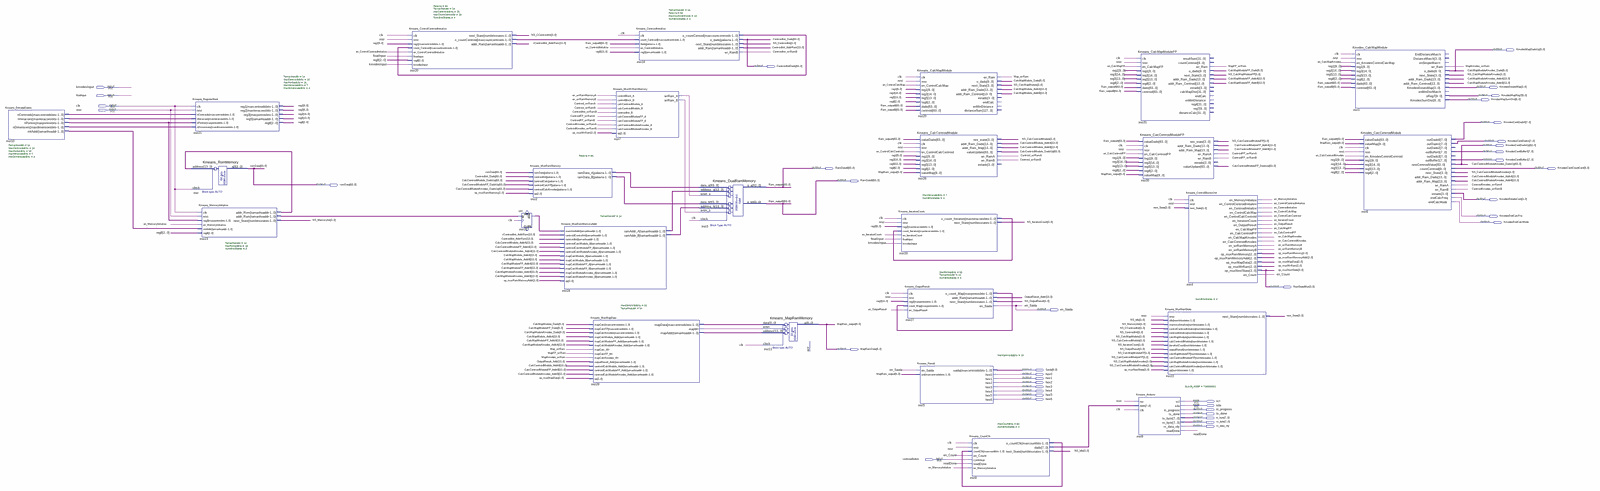
[diagram p0: schematic sheet, whole]
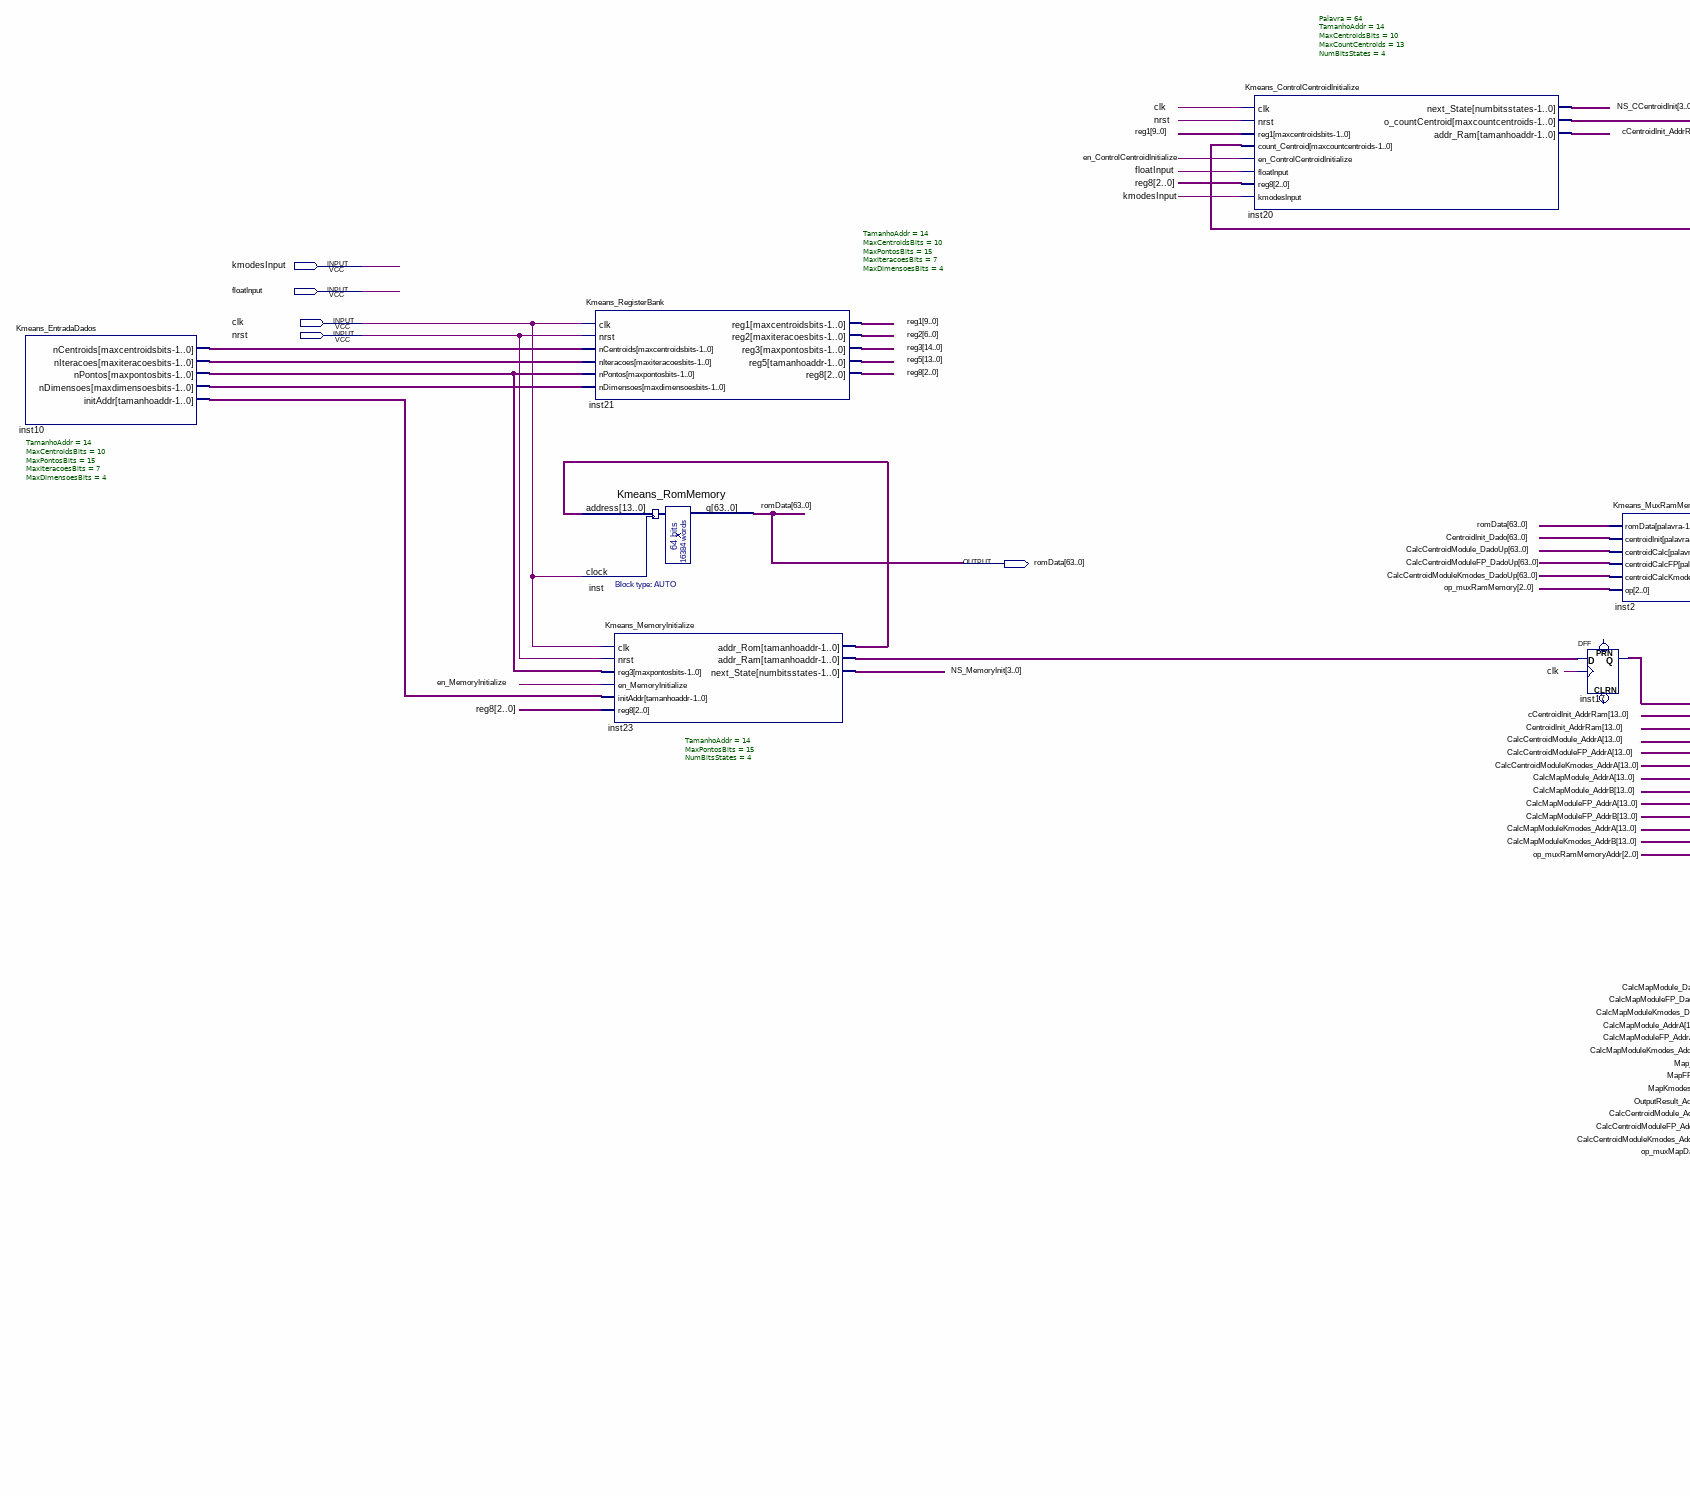
[diagram p1: schematic sheet, left part]
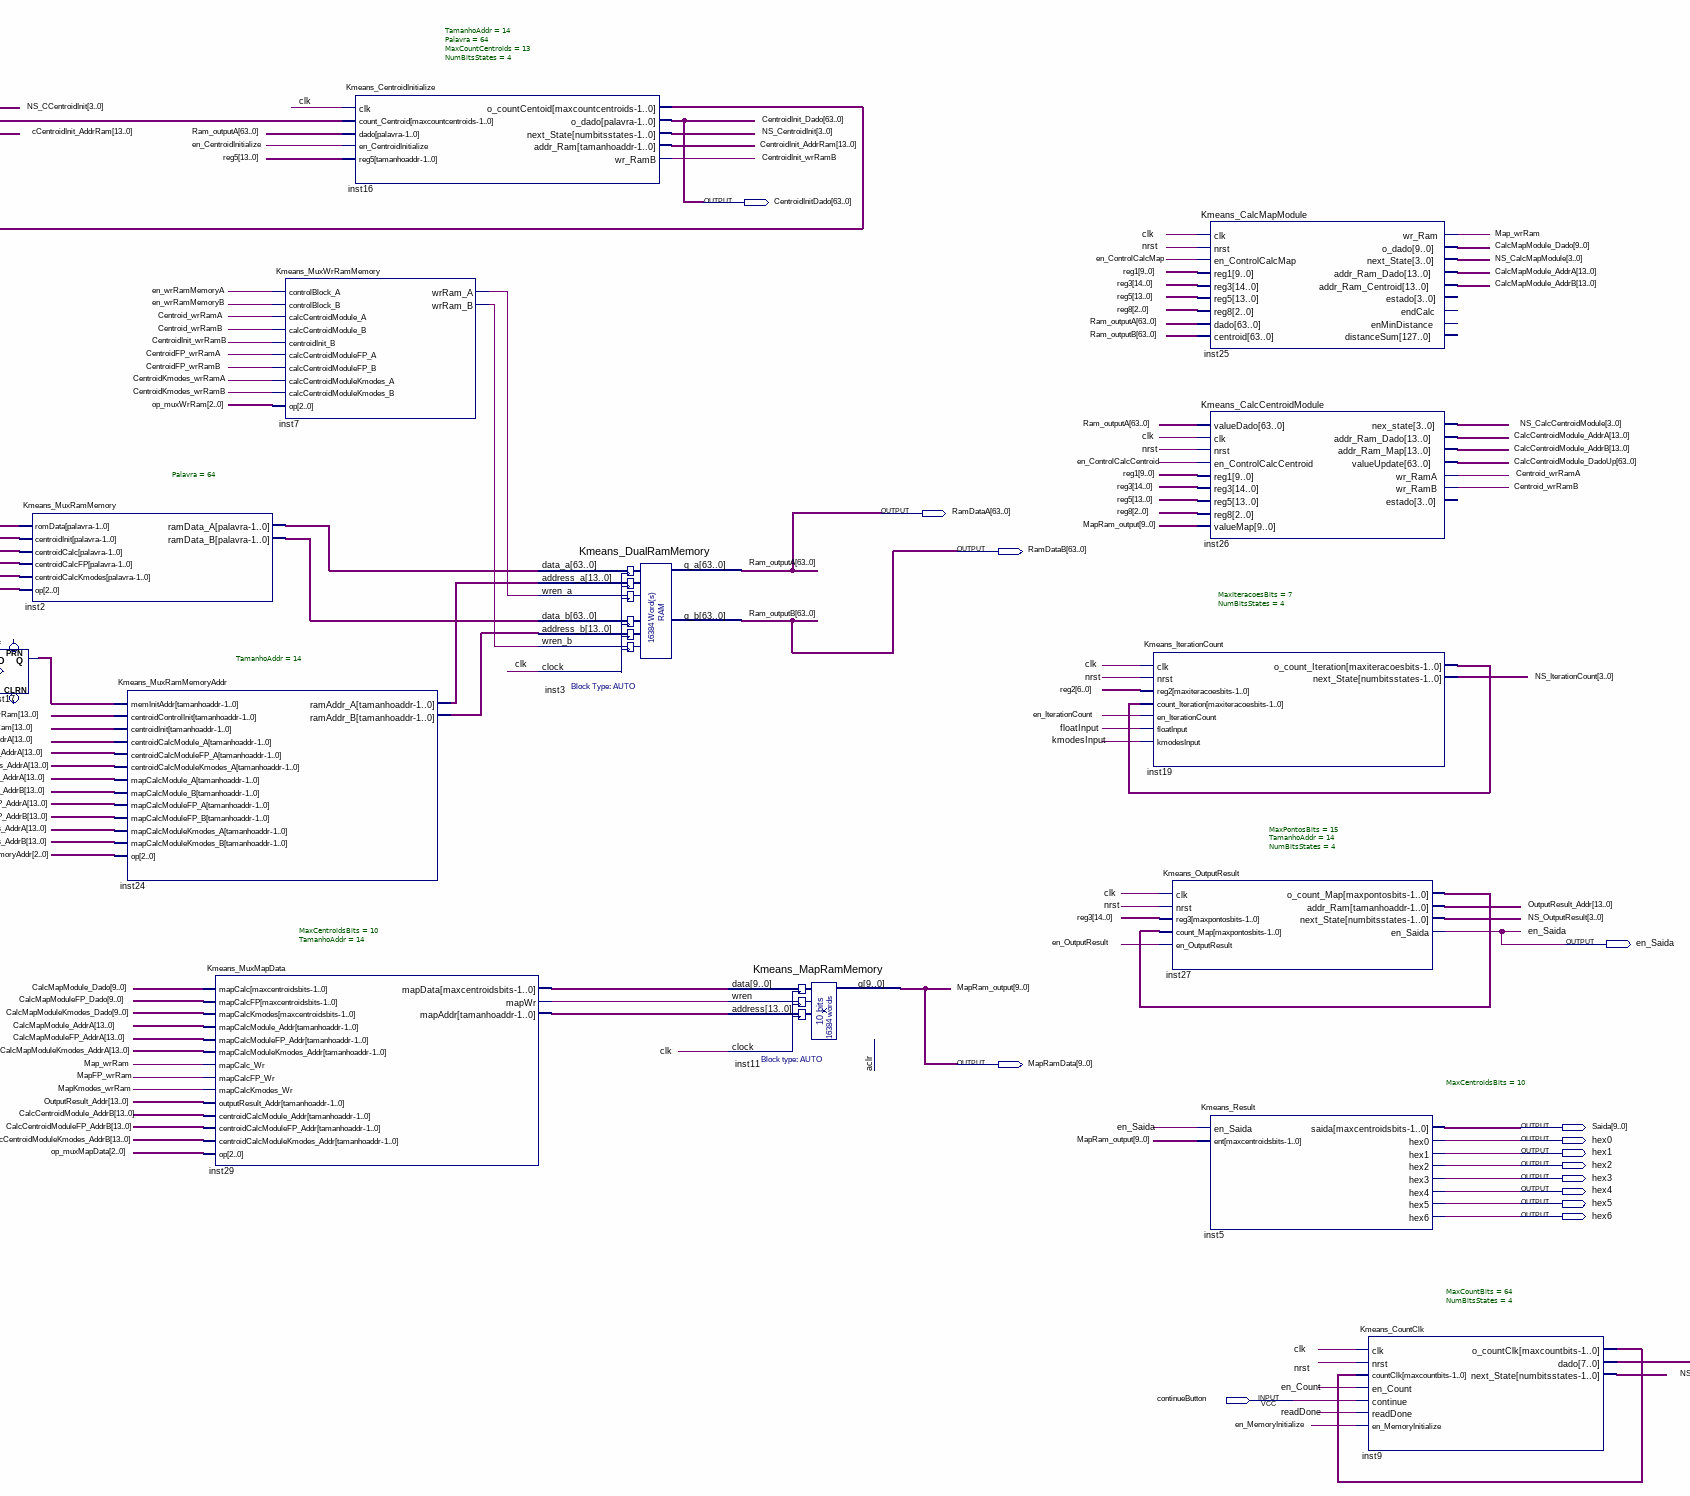
[diagram p2: schematic sheet, centre part]
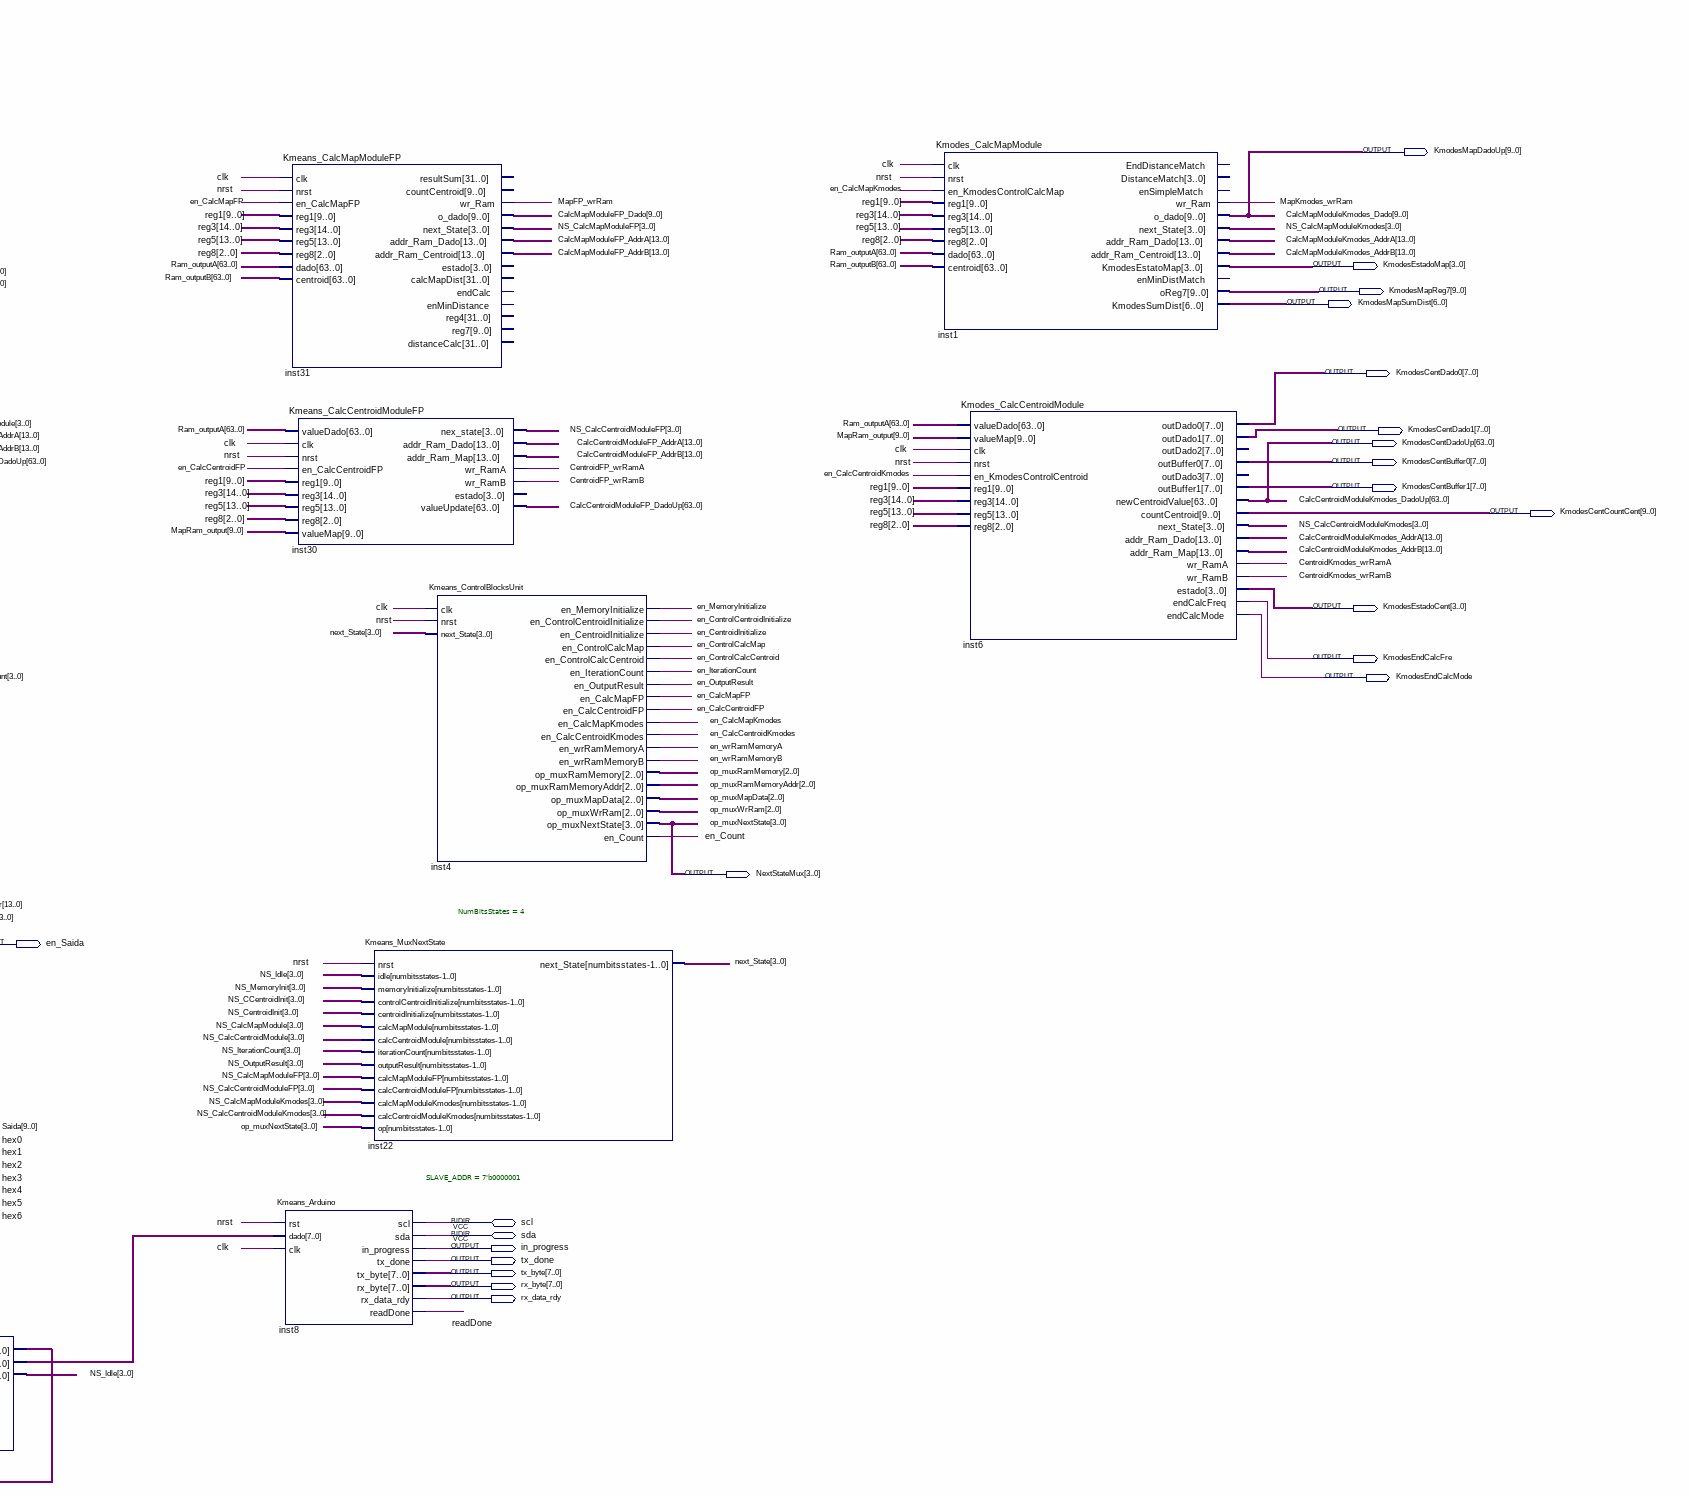
[diagram p3: schematic sheet, right part]
// Quartus schematic Kmeans_Processador.bdf as structural Verilog: 26 symbols, 40 pins
module Kmeans_Processador (
  input  kmodesInput,
  input  floatInput,
  input  clk,
  input  nrst,
  input  continueButton,
  inout  scl,
  inout  sda,
  output [9:0] KmodesMapDadoUp,
  output [63:0] CentroidInitDado,
  output [3:0] KmodesEstadoMap,
  output [9:0] KmodesMapReg7,
  output [6:0] KmodesMapSumDist,
  output [7:0] KmodesCentDado0,
  output [7:0] KmodesCentDado1,
  output [63:0] KmodesCentDadoUp,
  output [7:0] KmodesCentBuffer0,
  output [7:0] KmodesCentBuffer1,
  output [63:0] RamDataA,
  output [9:0] KmodesCentCountCent,
  output [63:0] RamDataB,
  output [63:0] romData,
  output [3:0] KmodesEstadoCent,
  output KmodesEndCalcFre,
  output KmodesEndCalcMode,
  output [3:0] NextStateMux,
  output en_Saida,
  output [9:0] MapRamData,
  output [9:0] Saida,
  output hex0,
  output hex1,
  output hex2,
  output hex3,
  output hex4,
  output hex5,
  output hex6,
  output in_progress,
  output tx_done,
  output [7:0] tx_byte,
  output [7:0] rx_byte,
  output rx_data_rdy
);

  wire Centroid_wrRamA, Centroid_wrRamB, CentroidFP_wrRamA, CentroidFP_wrRamB, CentroidInit_wrRamB,
       CentroidKmodes_wrRamA, CentroidKmodes_wrRamB, en_CalcCentroidFP, en_CalcCentroidKmodes, en_CalcMapFP,
       en_CalcMapKmodes, en_CentroidInitialize, en_ControlCalcCentroid, en_ControlCalcMap,
       en_ControlCentroidInitialize, en_Count, en_IterationCount, en_MemoryInitialize, en_OutputResult,
       en_wrRamMemoryA, en_wrRamMemoryB, inst7_wrram_a, inst7_wrram_b, inst29_mapwr, Map_wrRam, MapFP_wrRam,
       MapKmodes_wrRam, readDone;
  wire [2:0] op_muxMapData, op_muxRamMemory, op_muxRamMemoryAddr, op_muxWrRam, reg8;
  wire [3:0] inst10_ndimensoes, next_State, NS_CalcCentroidModule, NS_CalcCentroidModuleFP,
       NS_CalcCentroidModuleKmodes, NS_CalcMapModule, NS_CalcMapModuleFP, NS_CalcMapModuleKmodes,
       NS_CCentroidInit, NS_CentroidInit, NS_Idle, NS_IterationCount, NS_MemoryInit, NS_OutputResult;
  wire [6:0] inst10_niteracoes, inst19_o_count_iteration, reg2;
  wire [7:0] inst9_dado;
  wire [9:0] CalcMapModule_Dado, CalcMapModuleFP_Dado, inst10_ncentroids, inst29_mapdata, reg1;
  wire [12:0] inst16_o_countcentoid, inst20_o_countcentroid;
  wire [13:0] CalcCentroidModule_AddrA, CalcCentroidModule_AddrB, CalcCentroidModuleFP_AddrA,
       CalcCentroidModuleFP_AddrB, CalcCentroidModuleKmodes_AddrA, CalcCentroidModuleKmodes_AddrB,
       CalcMapModule_AddrA, CalcMapModule_AddrB, CalcMapModuleFP_AddrA, CalcMapModuleFP_AddrB,
       CalcMapModuleKmodes_AddrA, CalcMapModuleKmodes_AddrB, cCentroidInit_AddrRam, CentroidInit_AddrRam,
       inst10_initaddr, inst17_q, inst23_addr_ram, inst23_addr_rom, inst24_ramaddr_a, inst24_ramaddr_b,
       inst29_mapaddr, OutputResult_Addr, reg5;
  wire [14:0] inst10_npontos, inst27_o_count_map, reg3;
  wire [63:0] CalcCentroidModule_DadoUp, CalcCentroidModuleFP_DadoUp, inst2_ramdata_a, inst2_ramdata_b,
       inst9_o_countclk;

  Kmeans_EntradaDados #(.TamanhoAddr(14), .MaxCentroidsBits(10), .MaxPontosBits(15), .MaxIteracoesBits(7), .MaxDimensoesBits(4)) inst10 (
    .nCentroids(inst10_ncentroids), .nIteracoes(inst10_niteracoes), .nPontos(inst10_npontos),
    .nDimensoes(inst10_ndimensoes), .initAddr(inst10_initaddr));
  Kmeans_RegisterBank #(.TamanhoAddr(14), .MaxCentroidsBits(10), .MaxPontosBits(15), .MaxIteracoesBits(7), .MaxDimensoesBits(4)) inst21 (
    .clk(clk), .nrst(nrst), .nCentroids(inst10_ncentroids), .nIteracoes(inst10_niteracoes),
    .nPontos(inst10_npontos), .nDimensoes(inst10_ndimensoes), .reg1(reg1), .reg2(reg2), .reg3(reg3),
    .reg5(reg5), .reg8(reg8));
  Kmeans_RomMemory inst (.address(inst23_addr_rom), .clock(clk), .q(romData));
  Kmeans_MemoryInitialize #(.TamanhoAddr(14), .MaxPontosBits(15), .NumBitsStates(4)) inst23 (
    .clk(clk), .nrst(nrst), .reg3(inst10_npontos), .en_MemoryInitialize(en_MemoryInitialize),
    .initAddr(inst10_initaddr), .reg8(reg8), .addr_Rom(inst23_addr_rom), .addr_Ram(inst23_addr_ram),
    .next_State(NS_MemoryInit));
  Kmeans_ControlCentroidInitialize #(.Palavra(64), .TamanhoAddr(14), .MaxCentroidsBits(10), .MaxCountCentroids(13), .NumBitsStates(4)) inst20 (
    .clk(clk), .nrst(nrst), .reg1(reg1), .count_Centroid(inst16_o_countcentoid),
    .en_ControlCentroidInitialize(en_ControlCentroidInitialize), .floatInput(floatInput), .reg8(reg8),
    .kmodesInput(kmodesInput), .next_State(NS_CCentroidInit), .o_countCentroid(inst20_o_countcentroid),
    .addr_Ram(cCentroidInit_AddrRam));
  DFF inst17[13:0] (.CLK(clk), .D(inst23_addr_ram), .Q(inst17_q));  // open: CLRN, PRN
  Kmeans_MuxRamMemory #(.Palavra(64)) inst2 (
    .romData(romData), .centroidInit(CentroidInitDado), .centroidCalc(CalcCentroidModule_DadoUp),
    .centroidCalcFP(CalcCentroidModuleFP_DadoUp), .centroidCalcKmodes(KmodesCentDadoUp),
    .op(op_muxRamMemory), .ramData_A(inst2_ramdata_a), .ramData_B(inst2_ramdata_b));
  Kmeans_MuxRamMemoryAddr #(.TamanhoAddr(14)) inst24 (
    .memInitAddr(inst17_q), .centroidControlInit(cCentroidInit_AddrRam), .centroidInit(CentroidInit_AddrRam),
    .centroidCalcModule_A(CalcCentroidModule_AddrA), .centroidCalcModuleFP_A(CalcCentroidModuleFP_AddrA),
    .centroidCalcModuleKmodes_A(CalcCentroidModuleKmodes_AddrA), .mapCalcModule_A(CalcMapModule_AddrA),
    .mapCalcModule_B(CalcMapModule_AddrB), .mapCalcModuleFP_A(CalcMapModuleFP_AddrA),
    .mapCalcModuleFP_B(CalcMapModuleFP_AddrB), .mapCalcModuleKmodes_A(CalcMapModuleKmodes_AddrA),
    .mapCalcModuleKmodes_B(CalcMapModuleKmodes_AddrB), .op(op_muxRamMemoryAddr),
    .ramAddr_A(inst24_ramaddr_a), .ramAddr_B(inst24_ramaddr_b));
  Kmeans_MuxMapData #(.MaxCentroidsBits(10), .TamanhoAddr(14)) inst29 (
    .mapCalc(CalcMapModule_Dado), .mapCalcFP(CalcMapModuleFP_Dado), .mapCalcKmodes(KmodesMapDadoUp),
    .mapCalcModule_Addr(CalcMapModule_AddrA), .mapCalcModuleFP_Addr(CalcMapModuleFP_AddrA),
    .mapCalcModuleKmodes_Addr(CalcMapModuleKmodes_AddrA), .mapCalc_Wr(Map_wrRam), .mapCalcFP_Wr(MapFP_wrRam),
    .mapCalcKmodes_Wr(MapKmodes_wrRam), .outputResult_Addr(OutputResult_Addr),
    .centroidCalcModule_Addr(CalcCentroidModule_AddrB),
    .centroidCalcModuleFP_Addr(CalcCentroidModuleFP_AddrB),
    .centroidCalcModuleKmodes_Addr(CalcCentroidModuleKmodes_AddrB), .op(op_muxMapData),
    .mapData(inst29_mapdata), .mapWr(inst29_mapwr), .mapAddr(inst29_mapaddr));
  Kmeans_MuxWrRamMemory inst7 (
    .controlBlock_A(en_wrRamMemoryA), .controlBlock_B(en_wrRamMemoryB),
    .calcCentroidModule_A(Centroid_wrRamA), .calcCentroidModule_B(Centroid_wrRamB),
    .centroidInit_B(CentroidInit_wrRamB), .calcCentroidModuleFP_A(CentroidFP_wrRamA),
    .calcCentroidModuleFP_B(CentroidFP_wrRamB), .calcCentroidModuleKmodes_A(CentroidKmodes_wrRamA),
    .calcCentroidModuleKmodes_B(CentroidKmodes_wrRamB), .op(op_muxWrRam), .wrRam_A(inst7_wrram_a),
    .wrRam_B(inst7_wrram_b));
  Kmeans_CentroidInitialize #(.TamanhoAddr(14), .Palavra(64), .MaxCountCentroids(13), .NumBitsStates(4)) inst16 (
    .clk(clk), .count_Centroid(inst20_o_countcentroid), .dado(RamDataA),
    .en_CentroidInitialize(en_CentroidInitialize), .reg5(reg5), .o_countCentoid(inst16_o_countcentoid),
    .o_dado(CentroidInitDado), .next_State(NS_CentroidInit), .addr_Ram(CentroidInit_AddrRam),
    .wr_RamB(CentroidInit_wrRamB));
  Kmeans_DualRamMemory inst3 (
    .data_a(inst2_ramdata_a), .address_a(inst24_ramaddr_a), .wren_a(inst7_wrram_a), .data_b(inst2_ramdata_b),
    .address_b(inst24_ramaddr_b), .wren_b(inst7_wrram_b), .clock(clk), .q_a(RamDataA), .q_b(RamDataB));
  Kmeans_MapRamMemory inst11 (
    .data(inst29_mapdata), .wren(inst29_mapwr), .address(inst29_mapaddr), .clock(clk), .q(MapRamData));  // open: aclr
  Kmeans_IterationCount #(.MaxIteracoesBits(7), .NumBitsStates(4)) inst19 (
    .clk(clk), .nrst(nrst), .reg2(reg2), .count_Iteration(inst19_o_count_iteration),
    .en_IterationCount(en_IterationCount), .floatInput(floatInput), .kmodesInput(kmodesInput),
    .o_count_Iteration(inst19_o_count_iteration), .next_State(NS_IterationCount));
  Kmeans_OutputResult #(.MaxPontosBits(15), .TamanhoAddr(14), .NumBitsStates(4)) inst27 (
    .clk(clk), .nrst(nrst), .reg3(reg3), .count_Map(inst27_o_count_map), .en_OutputResult(en_OutputResult),
    .o_count_Map(inst27_o_count_map), .addr_Ram(OutputResult_Addr), .next_State(NS_OutputResult),
    .en_Saida(en_Saida));
  Kmeans_CalcMapModule inst25 (
    .clk(clk), .nrst(nrst), .en_ControlCalcMap(en_ControlCalcMap), .reg1(reg1), .reg3(reg3), .reg5(reg5),
    .reg8(reg8), .dado(RamDataA), .centroid(RamDataB), .wr_Ram(Map_wrRam), .o_dado(CalcMapModule_Dado),
    .next_State(NS_CalcMapModule), .addr_Ram_Dado(CalcMapModule_AddrA),
    .addr_Ram_Centroid(CalcMapModule_AddrB));  // open: estado, endCalc, enMinDistance, distanceSum
  Kmeans_CalcCentroidModule inst26 (
    .valueDado(RamDataA), .clk(clk), .nrst(nrst), .en_ControlCalcCentroid(en_ControlCalcCentroid),
    .reg1(reg1), .reg3(reg3), .reg5(reg5), .reg8(reg8), .valueMap(MapRamData),
    .nex_state(NS_CalcCentroidModule), .addr_Ram_Dado(CalcCentroidModule_AddrA),
    .addr_Ram_Map(CalcCentroidModule_AddrB), .valueUpdate(CalcCentroidModule_DadoUp),
    .wr_RamA(Centroid_wrRamA), .wr_RamB(Centroid_wrRamB));  // open: estado
  Kmeans_Result #(.MaxCentroidsBits(10)) inst5 (
    .en_Saida(en_Saida), .ent(MapRamData), .saida(Saida), .hex0(hex0), .hex1(hex1), .hex2(hex2), .hex3(hex3),
    .hex4(hex4), .hex5(hex5), .hex6(hex6));
  Kmeans_CountClk #(.MaxCountBits(64), .NumBitsStates(4)) inst9 (
    .clk(clk), .nrst(nrst), .countClk(inst9_o_countclk), .en_Count(en_Count), .\continue (continueButton),
    .readDone(readDone), .en_MemoryInitialize(en_MemoryInitialize), .o_countClk(inst9_o_countclk),
    .dado(inst9_dado), .next_State(NS_Idle));
  Kmeans_CalcMapModuleFP inst31 (
    .clk(clk), .nrst(nrst), .en_CalcMapFP(en_CalcMapFP), .reg1(reg1), .reg3(reg3), .reg5(reg5), .reg8(reg8),
    .dado(RamDataA), .centroid(RamDataB), .wr_Ram(MapFP_wrRam), .o_dado(CalcMapModuleFP_Dado),
    .next_State(NS_CalcMapModuleFP), .addr_Ram_Dado(CalcMapModuleFP_AddrA),
    .addr_Ram_Centroid(CalcMapModuleFP_AddrB));  // open: resultSum, countCentroid, estado, calcMapDist, endCalc, enMinDistance, reg4, reg7, distanceCalc
  Kmeans_CalcCentroidModuleFP inst30 (
    .valueDado(RamDataA), .clk(clk), .nrst(nrst), .en_CalcCentroidFP(en_CalcCentroidFP), .reg1(reg1),
    .reg3(reg3), .reg5(reg5), .reg8(reg8), .valueMap(MapRamData), .nex_state(NS_CalcCentroidModuleFP),
    .addr_Ram_Dado(CalcCentroidModuleFP_AddrA), .addr_Ram_Map(CalcCentroidModuleFP_AddrB),
    .wr_RamA(CentroidFP_wrRamA), .wr_RamB(CentroidFP_wrRamB), .valueUpdate(CalcCentroidModuleFP_DadoUp));  // open: estado
  Kmeans_Arduino #(.SLAVE_ADDR(7'b0000001)) inst8 (
    .rst(nrst), .dado(inst9_dado), .clk(clk), .in_progress(in_progress), .tx_done(tx_done),
    .rx_byte(rx_byte), .rx_data_rdy(rx_data_rdy), .readDone(readDone), .scl(scl), .sda(sda), .tx_byte(tx_byte));
  Kmeans_MuxNextState #(.NumBitsStates(4)) inst22 (
    .nrst(nrst), .idle(NS_Idle), .memoryInitialize(NS_MemoryInit),
    .controlCentroidInitialize(NS_CCentroidInit), .centroidInitialize(NS_CentroidInit),
    .calcMapModule(NS_CalcMapModule), .calcCentroidModule(NS_CalcCentroidModule),
    .iterationCount(NS_IterationCount), .outputResult(NS_OutputResult), .calcMapModuleFP(NS_CalcMapModuleFP),
    .calcCentroidModuleFP(NS_CalcCentroidModuleFP), .calcMapModuleKmodes(NS_CalcMapModuleKmodes),
    .calcCentroidModuleKmodes(NS_CalcCentroidModuleKmodes), .op(NextStateMux), .next_State(next_State));
  Kmeans_ControlBlocksUnit inst4 (
    .clk(clk), .nrst(nrst), .next_State(next_State), .en_MemoryInitialize(en_MemoryInitialize),
    .en_ControlCentroidInitialize(en_ControlCentroidInitialize),
    .en_CentroidInitialize(en_CentroidInitialize), .en_ControlCalcMap(en_ControlCalcMap),
    .en_ControlCalcCentroid(en_ControlCalcCentroid), .en_IterationCount(en_IterationCount),
    .en_OutputResult(en_OutputResult), .en_CalcMapFP(en_CalcMapFP), .en_CalcCentroidFP(en_CalcCentroidFP),
    .en_CalcMapKmodes(en_CalcMapKmodes), .en_CalcCentroidKmodes(en_CalcCentroidKmodes),
    .en_wrRamMemoryA(en_wrRamMemoryA), .en_wrRamMemoryB(en_wrRamMemoryB), .op_muxRamMemory(op_muxRamMemory),
    .op_muxRamMemoryAddr(op_muxRamMemoryAddr), .op_muxMapData(op_muxMapData), .op_muxWrRam(op_muxWrRam),
    .op_muxNextState(NextStateMux), .en_Count(en_Count));
  Kmodes_CalcMapModule inst1 (
    .clk(clk), .nrst(nrst), .en_KmodesControlCalcMap(en_CalcMapKmodes), .reg1(reg1), .reg3(reg3),
    .reg5(reg5), .reg8(reg8), .dado(RamDataA), .centroid(RamDataB), .wr_Ram(MapKmodes_wrRam),
    .o_dado(KmodesMapDadoUp), .next_State(NS_CalcMapModuleKmodes), .addr_Ram_Dado(CalcMapModuleKmodes_AddrA),
    .addr_Ram_Centroid(CalcMapModuleKmodes_AddrB), .KmodesEstatoMap(KmodesEstadoMap), .oReg7(KmodesMapReg7),
    .KmodesSumDist(KmodesMapSumDist));  // open: EndDistanceMatch, DistanceMatch, enSimpleMatch, enMinDistMatch
  Kmodes_CalcCentroidModule inst6 (
    .valueDado(RamDataA), .valueMap(MapRamData), .clk(clk), .nrst(nrst),
    .en_KmodesControlCentroid(en_CalcCentroidKmodes), .reg1(reg1), .reg3(reg3), .reg5(reg5), .reg8(reg8),
    .outDado0(KmodesCentDado0), .outDado1(KmodesCentDado1), .outBuffer0(KmodesCentBuffer0),
    .outBuffer1(KmodesCentBuffer1), .newCentroidValue(KmodesCentDadoUp), .countCentroid(KmodesCentCountCent),
    .next_State(NS_CalcCentroidModuleKmodes), .addr_Ram_Dado(CalcCentroidModuleKmodes_AddrA),
    .addr_Ram_Map(CalcCentroidModuleKmodes_AddrB), .wr_RamA(CentroidKmodes_wrRamA),
    .wr_RamB(CentroidKmodes_wrRamB), .estado(KmodesEstadoCent), .endCalcFreq(KmodesEndCalcFre),
    .endCalcMode(KmodesEndCalcMode));  // open: outDado2, outDado3

  // Other names for the same wires on the sheet: CentroidInit_Dado[63:0] = CentroidInitDado;
  //   CalcCentroidModuleKmodes_DadoUp[63:0] = KmodesCentDadoUp; CalcMapModuleKmodes_Dado[9:0] = KmodesMapDadoUp;
  //   MapRam_output[9:0] = MapRamData; op_muxNextState[3:0] = NextStateMux; Ram_outputA[63:0] = RamDataA;
  //   Ram_outputB[63:0] = RamDataB
endmodule
